# EAGLE design Audio-1 (EAGLE 7.2.0)
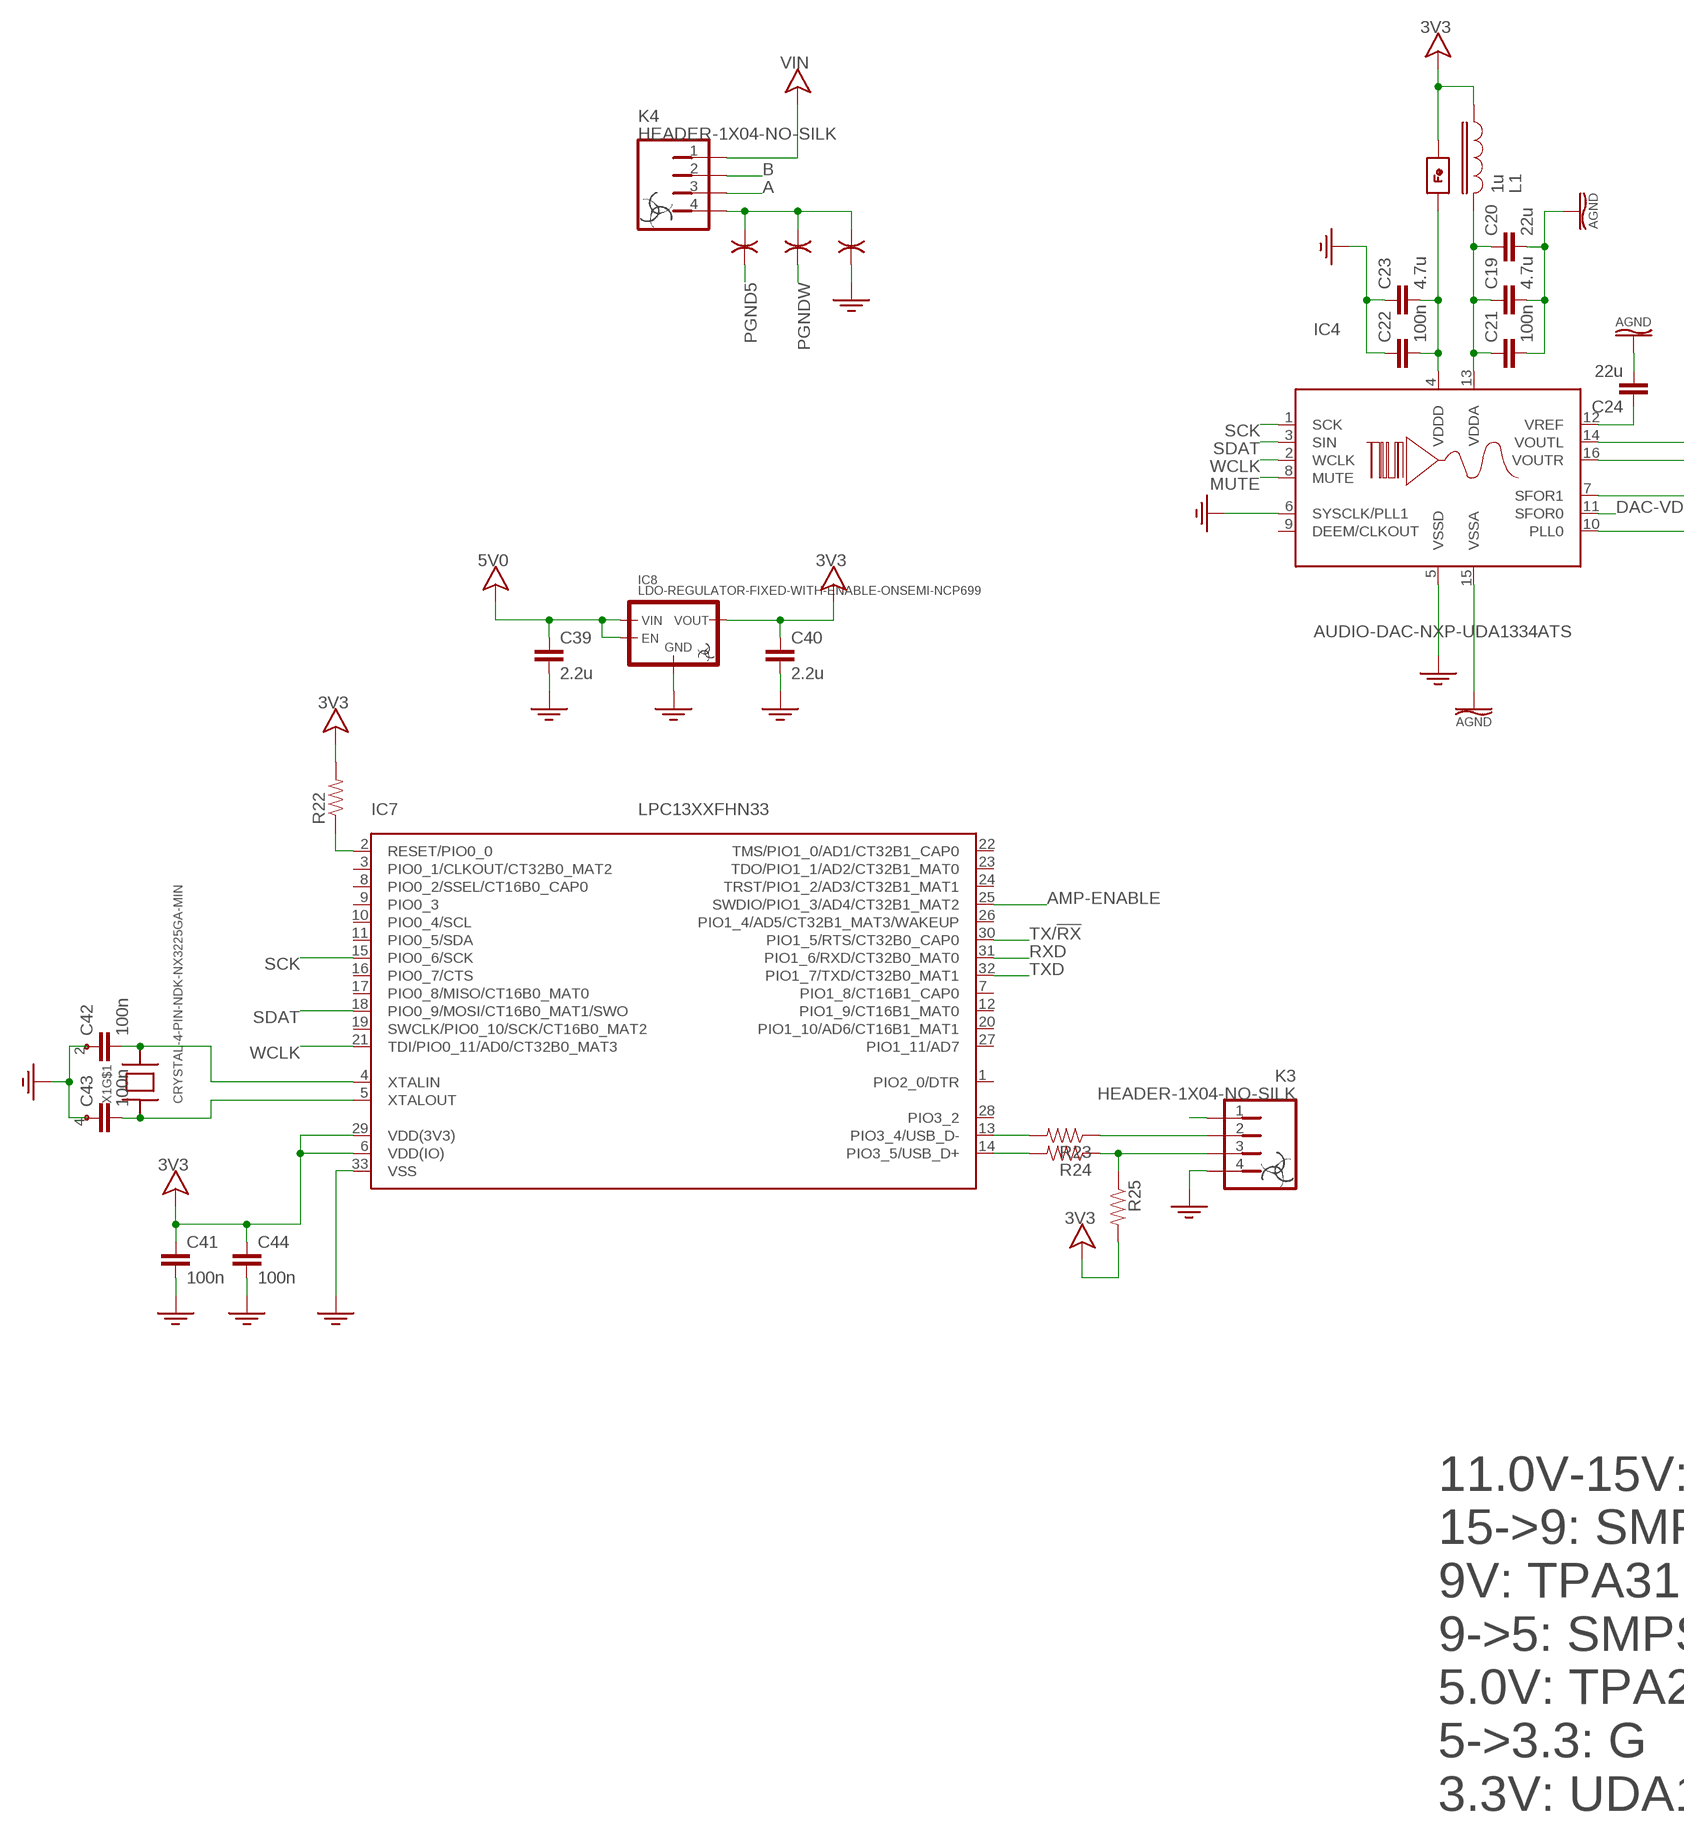
[diagram p0: schematic, sheet 1, part 1 of 2]
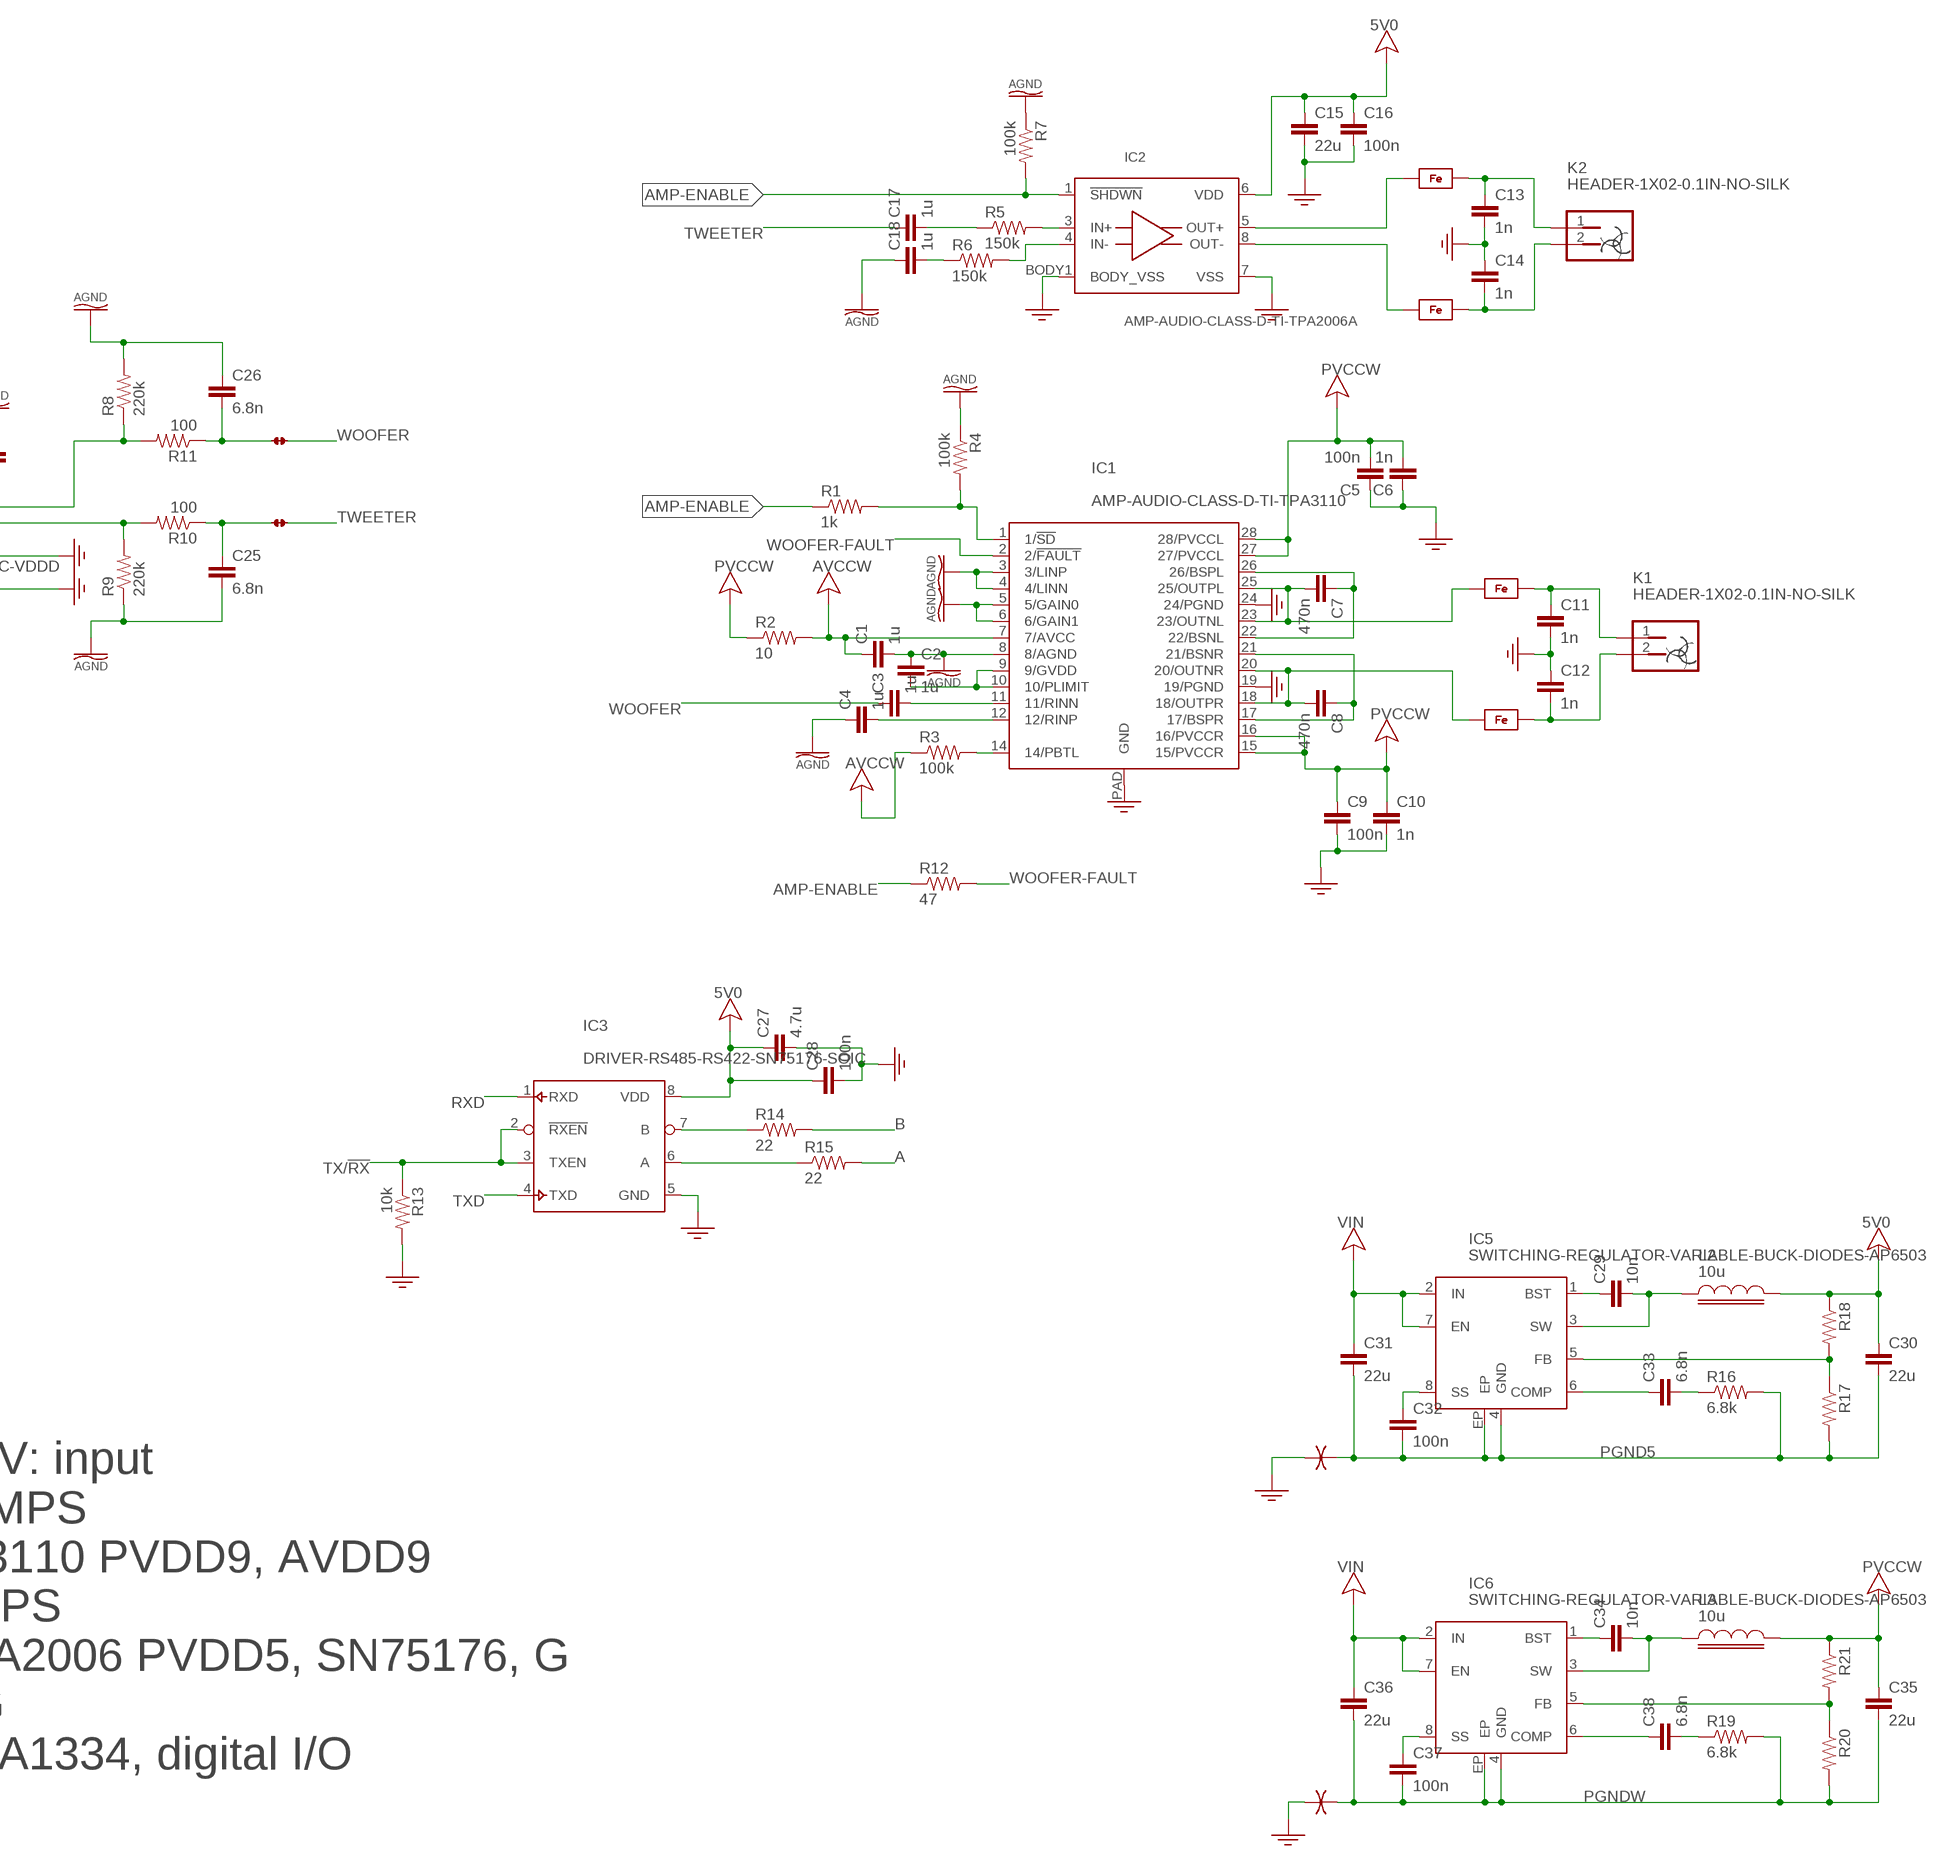
[diagram p1: schematic, sheet 1, part 2 of 2]

## Parts
C1  1u  CAP-0603-MIN  [0603-MIN]
C2  1u  CAP-0603-MIN  [0603-MIN]
C3  1u  CAP-0603-MIN  [0603-MIN]
C4  1u  CAP-0603-MIN  [0603-MIN]
C5  100n  CAP-0603-MIN  [0603-MIN]
C6  1n  CAP-0603-MIN  [0603-MIN]
C7  470n  CAP-0603-MIN  [0603-MIN]
C8  470n  CAP-0603-MIN  [0603-MIN]
C9  100n  CAP-0603-MIN  [0603-MIN]
C10  1n  CAP-0603-MIN  [0603-MIN]
C11  1n  CAP-0603-MIN  [0603-MIN]
C12  1n  CAP-0603-MIN  [0603-MIN]
C13  1n  CAP-0603-MIN  [0603-MIN]
C14  1n  CAP-0603-MIN  [0603-MIN]
C15  22u  CAP-1206-MIN  [1206-MIN]
C16  100n  CAP-0603-MIN  [0603-MIN]
C17  1u  CAP-0603-MIN  [0603-MIN]
C18  1u  CAP-0603-MIN  [0603-MIN]
C19  4.7u  CAP-0805-WIDE  [0805-WIDE]
C20  22u  CAP-1206-MIN  [1206-MIN]
C21  100n  CAP-0603-MIN  [0603-MIN]
C22  100n  CAP-0603-MIN  [0603-MIN]
C23  4.7u  CAP-0805-WIDE  [0805-WIDE]
C24  22u  CAP-1206-MIN  [1206-MIN]
C25  6.8n  CAP-0603  [0603]
C26  6.8n  CAP-0603  [0603]
C27  4.7u  CAP-0805  [0805]
C28  100n  CAP-0603-MIN  [0603-MIN]
C29  10n  CAP-0603-MIN  [0603-MIN]
C30  22u  CAP-1206  [1206]
C31  22u  CAP-1206  [1206]
C32  100n  CAP-0603-MIN  [0603-MIN]
C33  6.8n  CAP-0603-MIN  [0603-MIN]
C34  10n  CAP-0603-MIN  [0603-MIN]
C35  22u  CAP-1206  [1206]
C36  22u  CAP-1206  [1206]
C37  100n  CAP-0603-MIN  [0603-MIN]
C38  6.8n  CAP-0603-MIN  [0603-MIN]
C39  2.2u  CAP-0603-MIN  [0603-MIN]
C40  2.2u  CAP-0603-MIN  [0603-MIN]
C41  100n  CAP-0603-MIN  [0603-MIN]
C42  100n  CAP-0603-MIN  [0603-MIN]
C43  100n  CAP-0603-MIN  [0603-MIN]
C44  100n  CAP-0603-MIN  [0603-MIN]
FB1  FERRITE-BEAD-0603-MIN  [0603-MIN]
FB2  FERRITE-BEAD-0603-MIN  [0603-MIN]
FB3  FERRITE-BEAD-0603-MIN  [0603-MIN]
FB4  FERRITE-BEAD-0603-MIN  [0603-MIN]
FB5  FERRITE-BEAD-0603-MIN  [0603-MIN]
IC1  AMP-AUDIO-CLASS-D-TI-TPA3110  [SSOP28-5.3MM-POWERPAD]
IC2  AMP-AUDIO-CLASS-D-TI-TPA2006A  [QFN8-3X3MM-TI-TPA200X]
IC3  DRIVER-RS485-RS422-SN75176-SOIC  [EIAJ-SOIC8]
IC4  AUDIO-DAC-NXP-UDA1334ATS  [TSSOP16]
IC5  SWITCHING-REGULATOR-VARIABLE-BUCK-DIODES-AP6503  [EIAJ-SOIC8-3.9MM-EXPOSED-PAD]
IC6  SWITCHING-REGULATOR-VARIABLE-BUCK-DIODES-AP6503  [EIAJ-SOIC8-3.9MM-EXPOSED-PAD]
IC7  LPC13XXFHN33  [HVQFN33-7X7MM]
IC8  LDO-REGULATOR-FIXED-WITH-ENABLE-ONSEMI-NCP699  [SOT23-5]
J1  JUMPER-0805  [0805-JUMPER]
J2  JUMPER-0805  [0805-JUMPER]
K1  HEADER-1X02-0.1IN-NO-SILK  [HEADER-1X02-NO-SILK]
K2  HEADER-1X02-0.1IN-NO-SILK  [HEADER-1X02-NO-SILK]
K3  HEADER-1X04-NO-SILK  [HEADER-1X04-NO-SILK]
K4  HEADER-1X04-NO-SILK  [HEADER-1X04-NO-SILK]
L1  1u  INDUCTOR-0805-MIN  [0805-MIN]
L2  10u  INDUCTOR-1210  [1210]
L3  10u  INDUCTOR-1210  [1210]
R1  1k  RESISTOR-0603-MIN  [0603-MIN]
R2  10  RESISTOR-0603-MIN  [0603-MIN]
R3  100k  RESISTOR-0603-MIN  [0603-MIN]
R4  100k  RESISTOR-0603-MIN  [0603-MIN]
R5  150k  RESISTOR-0603-MIN  [0603-MIN]
R6  150k  RESISTOR-0603-MIN  [0603-MIN]
R7  100k  RESISTOR-0603-MIN  [0603-MIN]
R8  220k  RESISTOR-0603  [0603]
R9  220k  RESISTOR-0603  [0603]
R10  100  RESISTOR-0603  [0603]
R11  100  RESISTOR-0603  [0603]
R12  47  RESISTOR-0603-MIN  [0603-MIN]
R13  10k  RESISTOR-0603-MIN  [0603-MIN]
R14  22  RESISTOR-0805  [0805-MIN]
R15  22  RESISTOR-0805  [0805-MIN]
R16  6.8k  RESISTOR-0603-MIN  [0603-MIN]
R17  RESISTOR-0603-MIN  [0603-MIN]
R18  RESISTOR-0603-MIN  [0603-MIN]
R19  6.8k  RESISTOR-0603-MIN  [0603-MIN]
R20  RESISTOR-0603-MIN  [0603-MIN]
R21  RESISTOR-0603-MIN  [0603-MIN]
R22  RESISTOR-0603-MIN  [0603-MIN]
R23  RESISTOR-0603-MIN  [0603-MIN]
R24  RESISTOR-0603-MIN  [0603-MIN]
R25  RESISTOR-0603-MIN  [0603-MIN]
U1  GND-ISOLATOR-0.032"  [GND-ISOLATOR-0.032"]
U2  GND-ISOLATOR-0.032"  [GND-ISOLATOR-0.032"]
U3  GND-ISOLATOR-0.032"  [GND-ISOLATOR-0.032"]
U4  GND-ISOLATOR-0.032"  [GND-ISOLATOR-0.032"]
U5  GND-ISOLATOR-0.032"  [GND-ISOLATOR-0.032"]
X1  CRYSTAL-4-PIN-NDK-NX3225GA-MIN  [CRYSTAL-NDK-NX3225GA-3X2.5MM-MIN]

## Nets
3V3: C40.2 C41.2 C44.2 FB5.2 IC7.6(VDD(IO)) IC7.29(VDD(3V3)) IC8.5(VOUT) L1.2 R22.2 R25.2 ; supply symbol labelled V
5V0: C15.2 C16.2 C27.2 C28.2 C30.2 C39.2 IC2.6(VDD) IC3.8(VDD) IC8.1(VIN) IC8.3(EN) L2.2 R18.1 ; supply symbol labelled V
5V0FB: IC5.5(FB) R17.1 R18.2
!WOOFER-SD: IC1.1(1/!SD) R1.2 R4.2
A: K4.3 R15.2
AGND: C1.1 C2.2 C4.2 C18.2 C19.1 C20.1 C21.1 C24.1 C25.1 C26.2 IC1.3(3/LINP) IC1.4(4/LINN) IC1.5(5/GAIN0) IC1.6(6/GAIN1) IC1.8(8/AGND) IC4.15(VSSA) R4.1 R7.1 R8.2 R9.1
AMP-ENABLE: IC2.1(!SHDWN) IC7.25(SWDIO/PIO1_3/AD4/CT32B1_MAT2) R1.1 R7.2 R12.1
AVCCW: C1.2 IC1.7(7/AVCC) R2.2 R3.1 ; supply symbol labelled V
B: K4.2 R14.2
BSL: C7.2 IC1.22(22/BSNL) IC1.26(26/BSPL)
BSR: C8.2 IC1.17(17/BSPR) IC1.21(21/BSNR)
D+: K3.3 R24.1 R25.1
D-: K3.2 R23.1
DAC-TO: C25.2 J2.1 R10.1
DAC-VDDA: C19.2 C20.2 C21.2 IC4.13(VDDA) L1.1
DAC-VDDD: C22.1 C23.1 FB5.1 IC4.4(VDDD) IC4.11(SFOR0)
DAC-VOUT-TO: IC4.16(VOUTR) R9.2 R10.2
DAC-VOUT-WO: IC4.14(VOUTL) R8.1 R11.2
DAC-WO: C26.1 J1.1 R11.1
GND: C5.2 C6.2 C9.1 C10.1 C11.1 C12.2 C13.1 C14.2 C15.1 C16.1 C22.2 C23.2 C27.1 C28.1 C39.1 C40.1 C41.1 C42.2 C43.2 C44.1 IC1.19(19/PGND) IC1.24(24/PGND) IC1.PAD(GND) IC2.7(VSS) IC2.BODY1(BODY_VSS) IC3.5(GND) IC4.5(VSSD) IC4.6(SYSCLK/PLL1) IC4.7(SFOR1) IC4.10(PLL0) IC7.33(VSS) IC8.2(GND) K3.4 R13.2 U3.A U4.B U5.B X1.2 X1.4
GVDD: C2.1 IC1.9(9/GVDD) IC1.10(10/PLIMIT)
MUTE: IC4.8(MUTE)
N$1: IC3.7(B) R14.1
N$2: C24.2 IC4.12(VREF)
N$3: IC3.6(A) R15.1
N$4: C29.1 IC5.3(SW) L2.1
N$5: C29.2 IC5.1(BST)
N$6: C34.1 IC6.3(SW) L3.1
N$7: C34.2 IC6.1(BST)
N$8: FB3.1 IC2.5(OUT+)
N$9: IC1.14(14/PBTL) R3.2
N$10: C38.2 IC6.6(COMP)
N$11: C33.2 IC5.6(COMP)
N$12: FB4.1 IC2.8(OUT-)
N$13: C14.1 FB4.2 K2.2
N$14: C13.2 FB3.2 K2.1
N$15: C33.1 R16.1
N$16: C38.1 R19.1
N$17: C32.2 IC5.8(SS)
N$18: C37.2 IC6.8(SS)
N$19: IC7.2(RESET/PIO0_0) R22.1
N$20: IC2.3(IN+) R5.2
N$21: IC2.4(IN-) R6.2
N$22: C18.1 R6.1
N$23: C17.1 R5.1
N$24: IC7.13(PIO3_4/USB_D-) R23.2
N$25: IC7.14(PIO3_5/USB_D+) R24.2
N$26: C43.1 IC7.5(XTALOUT) X1.1
N$27: C42.1 IC7.4(XTALIN) X1.3
N$28: K4.4 U1.B U2.B U3.B
N$30: K3.1
OUTL: C7.1 FB1.1 IC1.23(23/OUTNL) IC1.25(25/OUTPL)
OUTR: C8.1 FB2.1 IC1.18(18/OUTPR) IC1.20(20/OUTNR)
PGND5: C30.1 C31.1 C32.1 IC5.4(GND) IC5.EP R16.2 R17.2 U1.A U4.A
PGNDW: C35.1 C36.1 C37.1 IC6.4(GND) IC6.EP R19.2 R20.2 U2.A U5.A
PVCCW: C5.1 C6.1 C9.2 C10.2 C35.2 IC1.15(15/PVCCR) IC1.16(16/PVCCR) IC1.27(27/PVCCL) IC1.28(28/PVCCL) L3.2 R2.1 R21.1 ; supply symbol labelled V
RINN: C3.1 IC1.11(11/RINN)
RINP: C4.1 IC1.12(12/RINP)
RXD: IC3.1(RXD) IC7.31(PIO1_6/RXD/CT32B0_MAT0)
SCK: IC4.1(SCK) IC7.15(PIO0_6/SCK)
SDAT: IC4.3(SIN) IC7.18(PIO0_9/MOSI/CT16B0_MAT1/SWO)
TWEETER: C17.2 J2.2
TX/!RX: IC3.2(!RXEN) IC3.3(TXEN) IC7.30(PIO1_5/RTS/CT32B0_CAP0) R13.1
TXD: IC3.4(TXD) IC7.32(PIO1_7/TXD/CT32B0_MAT1)
VIN: C31.2 C36.2 IC5.2(IN) IC5.7(EN) IC6.2(IN) IC6.7(EN) K4.1 ; supply symbol labelled V
WCLK: IC4.2(WCLK) IC7.21(TDI/PIO0_11/AD0/CT32B0_MAT3)
WFB: IC6.5(FB) R20.1 R21.2
WOOFER: C3.2 J1.2
WOOFER-FAULT: IC1.2(2/!FAULT) R12.2
WOOFERL: C11.2 FB1.2 K1.1
WOOFERR: C12.1 FB2.2 K1.2
Unconnected: IC4.9(DEEM/CLKOUT) IC7.1(PIO2_0/DTR) IC7.3(PIO0_1/CLKOUT/CT32B0_MAT2) IC7.7(PIO1_8/CT16B1_CAP0) IC7.8(PIO0_2/SSEL/CT16B0_CAP0) IC7.9(PIO0_3) IC7.10(PIO0_4/SCL) IC7.11(PIO0_5/SDA) IC7.12(PIO1_9/CT16B1_MAT0) IC7.16(PIO0_7/CTS) IC7.17(PIO0_8/MISO/CT16B0_MAT0) IC7.19(SWCLK/PIO0_10/SCK/CT16B0_MAT2) IC7.20(PIO1_10/AD6/CT16B1_MAT1) IC7.22(TMS/PIO1_0/AD1/CT32B1_CAP0) IC7.23(TDO/PIO1_1/AD2/CT32B1_MAT0) IC7.24(TRST/PIO1_2/AD3/CT32B1_MAT1) IC7.26(PIO1_4/AD5/CT32B1_MAT3/WAKEUP) IC7.27(PIO1_11/AD7) IC7.28(PIO3_2)

## Notes on the sheet
- 11.0V-15V: input
  15->9: SMPS
  9V: TPA3110 PVDD9, AVDD9
  9->5: SMPS
  5.0V: TPA2006 PVDD5, SN75176, G
  5->3.3: G
  3.3V: UDA1334, digital I/O

## Library data of the parts
C1-C44 = Outbreak:CAP
FB1-FB5 = Outbreak:FERRITE-BEAD
IC1 = Outbreak:AMP-AUDIO-CLASS-D-TI-TPA3110
IC2 = Outbreak:AMP-AUDIO-CLASS-D-TI-TPA2006A
IC3 = Outbreak:DRIVER-RS485-RS422-SN75176
IC4 = Outbreak:AUDIO-DAC-NXP-UDA1334ATS
IC5 IC6 = Outbreak:SWITCHING-REGULATOR-VARIABLE-BUCK-DIODES-AP6503
IC7 = Outbreak:LPC13XXFHN33: LPC1313 72 MHz 32-bit ARM Cortex-M3 based microcontroller featuring a high level of integration and low power consumption. 32 kB Flash, 8 kB SRAM MarcVl - Datasheet available on www.nxp.com
IC8 = Outbreak:LDO-REGULATOR-FIXED-WITH-ENABLE: Low Drop-Out (LDO) Volt Regulator with enable pin (active at logic high.)
J1 J2 = Outbreak:JUMPER
K1 K2 = Outbreak:HEADER-1X02
K3 K4 = Outbreak:HEADER-1X04-NO-SILK
L1-L3 = Outbreak:INDUCTOR
R1-R25 = Outbreak:RESISTOR: Resistor Basic schematic elements and footprints for 0603, 1206, and PTH resistors.
U1-U5 = Outbreak:GND-ISOLATOR
X1 = Outbreak:CRYSTAL-4-PIN

## Board
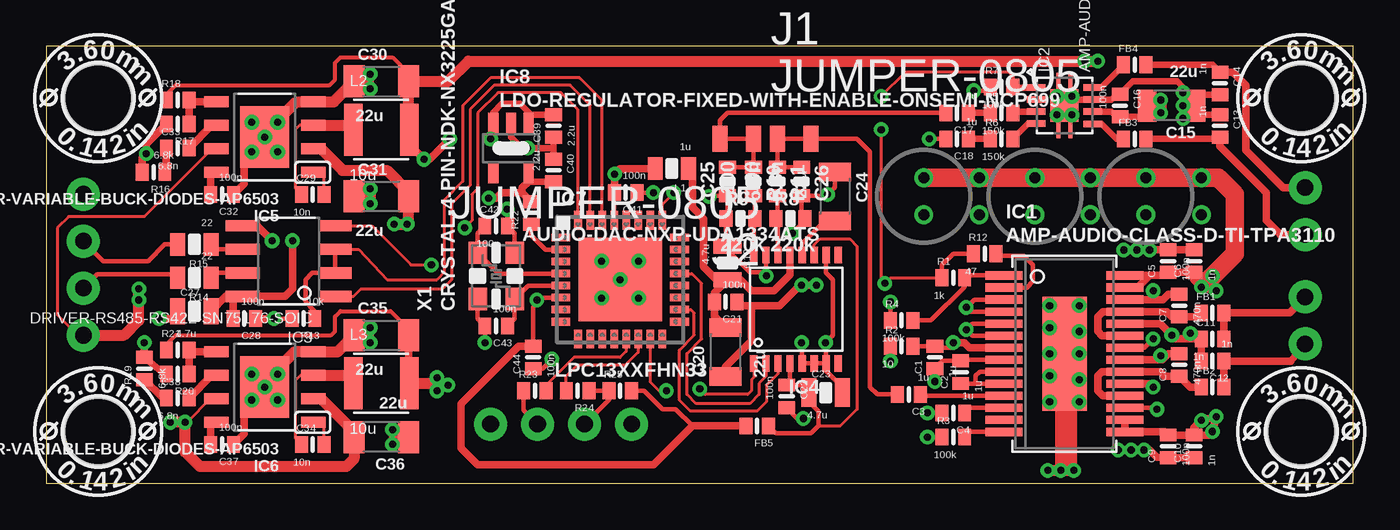
[diagram p2: board, top side]
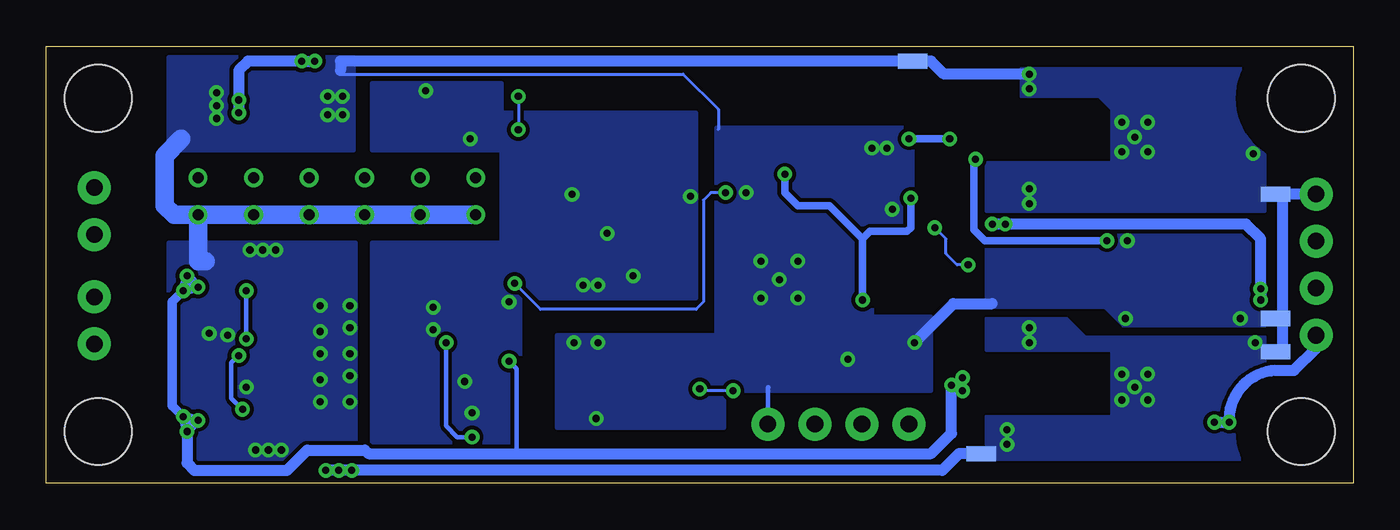
[diagram p3: board, bottom side, seen from below]

Size 70.6 x 23.6 mm. Coordinates in mm from the lower left corner, seen from the top.
Outline: 0,0 70.6,0 70.6,23.6 0,23.6 0,0
Copper layers (1*16): Top 0.035mm / dielectric 1.5mm / Bottom 0.035mm
Design rules "default *": minimum track width 10mil, minimum drill 24mil, track to track 8mil, track to pad 8mil, pad to pad 8mil, via to via 8mil, smd to smd 8mil, copper to edge 10mil, drill to drill 8mil, minimum pad ring 10mil, minimum via ring 8mil, stop-mask expansion 4mil, vias tented up to drill 20mil, thermal gap 10mil

### Footprints (pad centres in the part's own frame; a part is rotated, then mirrored left to right if it is on the bottom)
0603-MIN = smd 0.7 x 0.9: 1 -0.61,0; 2 0.61,0
1206-MIN = smd 1 x 1.727: 1 -1.323,0; 2 1.323,0
0805-WIDE = smd 0.8 x 1.524: 1 -0.9,0; 2 0.9,0
0603 = smd 0.7 x 0.9: 1 -0.777,0; 2 0.777,0
0805 = smd 0.8 x 1.397: 1 -0.9,0; 2 0.9,0
1206 = smd 1.143 x 1.727: 1 -1.473,0; 2 1.473,0
SSOP28-5.3MM-POWERPAD = smd 2 x 0.44: 1 -3.275,4.225; 2 -3.275,3.575; 3 -3.275,2.925; 4 -3.275,2.275; 5 -3.275,1.625; 6 -3.275,0.975; 7 -3.275,0.325; 8 -3.275,-0.325; 9 -3.275,-0.975; 10 -3.275,-1.625; 11 -3.275,-2.275; 12 -3.275,-2.925; 13 -3.275,-3.575; 14 -3.275,-4.225; 15 3.275,-4.225; 16 3.275,-3.575; 17 3.275,-2.925; 18 3.275,-2.275; 19 3.275,-1.625; 20 3.275,-0.975; 21 3.275,-0.325; 22 3.275,0.325; 23 3.275,0.975; 24 3.275,1.625; 25 3.275,2.275; 26 3.275,2.925; 27 3.275,3.575; 28 3.275,4.225 | smd 2.4 x 6.17: PAD 0,0
QFN8-3X3MM-TI-TPA200X = smd 0.35 x 1: 1 0.975,1.525; 2 0.325,1.525; 3 -0.325,1.525; 4 -0.975,1.525; 5 -0.985,-1.525; 6 -0.325,-1.525; 7 0.325,-1.525; 8 0.975,-1.525 | smd 1.75 x 1.5: BODY1 0,0 | smd 0.9 x 0.23: BODY2 -1.325,0.325; BODY3 -1.325,-0.325; BODY4 1.325,-0.325; BODY5 1.325,0.325
EIAJ-SOIC8 = smd 1.829 x 0.61: 1 -2.491,1.905; 2 -2.491,0.635; 3 -2.491,-0.635; 4 -2.491,-1.905; 5 2.491,-1.905; 6 2.491,-0.635; 7 2.491,0.635; 8 2.491,1.905
TSSOP16 = smd 0.4 x 0.9: 1 2.275,2.925; 2 1.625,2.925; 3 0.975,2.925; 4 0.325,2.925; 5 -0.325,2.925; 6 -0.975,2.925; 7 -1.625,2.925; 8 -2.275,2.925; 9 -2.275,-2.925; 10 -1.625,-2.925; 11 -0.975,-2.925; 12 -0.325,-2.925; 13 0.325,-2.925; 14 0.975,-2.925; 15 1.625,-2.925; 16 2.275,-2.925
EIAJ-SOIC8-3.9MM-EXPOSED-PAD = smd 1.321 x 0.61: 1 -2.618,1.905; 2 -2.618,0.635; 3 -2.618,-0.635; 4 -2.618,-1.905; 5 2.618,-1.905; 6 2.618,-0.635; 7 2.618,0.635; 8 2.618,1.905 | smd 2.66 x 3.3: EP 0,0
HVQFN33-7X7MM = smd 1.013 x 0.406: 1 -3.2,2.275; 2 -3.2,1.625; 3 -3.2,0.975; 4 -3.2,0.325; 5 -3.2,-0.325; 6 -3.2,-0.975; 7 -3.2,-1.625; 8 -3.2,-2.275; 17 3.2,-2.275; 18 3.2,-1.625; 19 3.2,-0.975; 20 3.2,-0.325; 21 3.2,0.325; 22 3.2,0.975; 23 3.2,1.625; 24 3.2,2.275 | smd 0.406 x 1.013: 9 -2.275,-3.2; 10 -1.625,-3.2; 11 -0.975,-3.2; 12 -0.325,-3.2; 13 0.325,-3.2; 14 0.975,-3.2; 15 1.625,-3.2; 16 2.275,-3.2; 25 2.275,3.2; 26 1.625,3.2; 27 0.975,3.2; 28 0.325,3.2; 29 -0.325,3.2; 30 -0.975,3.2; 31 -1.625,3.2; 32 -2.275,3.2 | smd 4.5 x 4.5: 33 0,0
SOT23-5 = smd 0.55 x 1.2: 1 0.95,1.3; 2 0,1.3; 3 -0.95,1.3; 4 -0.95,-1.3; 5 0.95,-1.3
0805-JUMPER = smd 0.8 x 1.397: 1 -0.9,0; 2 0.9,0
HEADER-1X02-NO-SILK = drill 0.9 pad 1.778: 1 -1.27,0; 2 1.27,0
HEADER-1X04-NO-SILK = drill 0.9 pad 1.778: 1 0,0; 2 2.54,0; 3 5.08,0; 4 7.62,0
0805-MIN = smd 0.8 x 1.2: 1 -0.9,0; 2 0.9,0
1210 = smd 1 x 2.8: 1 -1.5,0; 2 1.5,0
GND-ISOLATOR-0.032" = smd 0.813 x 0.813: A -0.381,0; B 0.381,0
MOUNTING-HOLE-3.6MM-LABELLED-DIAM = hole 3.619: 0,0
CRYSTAL-NDK-NX3225GA-3X2.5MM-MIN = smd 1.2 x 1: 1 -1.25,-1; 2 1.25,-1; 3 1.25,1; 4 -1.25,1

### Placement (x,y rotation side)
C1  48,6.8 90 top
C2  49.4,6 90 top
C3  46.6,4.8 180 top
C4  49,3.8 180 top
C5  60.6,12 90 top
C6  62,12 90 top
C7  61.2,9.6 90 top
C8  61.2,6.4 90 top
C9  60.6,2 90 top
C10  62,2 90 top
C11  63,7.8 0 top
C12  63,6.6 180 top
C13  63.4,19.3 270 top
C14  63.4,21.6 270 top
C15  60.8,20.4 180 top
C16  58,20.4 270 top
C17  49.2,20 180 top
C18  49.2,18.6 180 top
C19  36.8,11.9 270 top
C20  36.7,7.1 90 top
C21  36.7,9.8 180 top
C22  40,4.7 270 top
C23  42.1,4.9 0 top
C24  42.6,15.5 270 top
C25  36.8,16.3 90 top
C26  40.8,16.3 270 top
C27  8,9.3 0 top
C28  10.7,8.9 180 top
C29  14.4,15.6 0 top
C30  18.1,21.7 0 top
C31  18.1,15.5 0 top
C32  9.5,15.6 180 top
C33  7.1,18.1 0 top
C34  14.4,2.1 0 top
C35  18.1,8 0 top
C36  18.1,2.5 180 top
C37  9.5,2.1 180 top
C38  7.1,4.6 0 top
C39  27.4,19.3 90 top
C40  27.4,16.9 270 top
C41  31.3,15.7 180 top
C42  24.3,13.9 0 top
C43  24.3,8.5 180 top
C44  26.3,6.8 90 top
FB1  63,9.2 0 top
FB2  63,5.2 0 top
FB3  58.8,18.6 0 top
FB4  58.8,22.6 0 top
FB5  38.4,3.1 180 top
IC1  55,7 0 top
IC2  55,20.4 90 top
IC3  13.1,12 180 top
IC4  40.5,9.4 180 top
IC5  11.8,18.7 180 top
IC6  11.8,5.2 180 top
IC7  31,11 0 top
IC8  25.1,18.1 0 top
J1  40.4,18.6 0 top
J2  37.3,18.6 180 top
K1  68,8.8 270 top
K2  68,14.7 90 top
K3  24,3.2 0 top
K4  2,8 90 top
L1  33.8,17 180 top
L2  18.1,19.1 0 top
L3  18.1,5.4 0 top
R1  49,11.1 0 top
R2  46.2,7.4 0 top
R3  49,2.5 0 top
R4  46.2,8.8 0 top
R5  51.6,20 0 top
R6  51.6,18.6 0 top
R7  51.6,21.4 0 top
R8  40.2,14.3 0 top
R9  37.5,14.3 0 top
R10  38.2,16.3 270 top
R11  39.5,16.3 270 top
R12  50.7,12.4 0 top
R13  13.9,8.9 180 top
R14  8,11.1 180 top
R15  8,12.9 180 top
R16  5.8,16.8 180 top
R17  7.1,19.4 180 top
R18  7.1,20.7 0 top
R19  5.3,6.2 90 top
R20  7.1,5.9 180 top
R21  7.1,7.2 0 top
R22  26.2,14.6 90 top
R23  26.4,5 0 top
R24  28.7,5 180 top
R25  31,5 0 top
U1  4.2,15.6 0 bottom
U2  4.2,7.1 0 bottom
U3  4.2,8.9 0 bottom
U4  23.8,22.8 180 bottom
U5  20.1,1.6 180 bottom
U$1  [MOUNTING-HOLE-3.6MM-LABELLED-DIAM]  2.8,2.8 0 top
U$9  [MOUNTING-HOLE-3.6MM-LABELLED-DIAM]  67.8,2.8 0 top
U$10  [MOUNTING-HOLE-3.6MM-LABELLED-DIAM]  2.8,20.8 0 top
U$16  [MOUNTING-HOLE-3.6MM-LABELLED-DIAM]  67.8,20.8 0 top
X1  24.3,11.2 90 top

### Tracks (layer width: path | path; a pad name or v marks a point on that pad's centre or on a via)
3V3  (via drill 0.38)
  Top 0.25: R25.2 32.3,5 33.3,4 34,4
  Top 0.254: IC7.6 26.82,10.03 26.7,9.9 | 26.7,9.9 26.3,9.5 C44.2 | IC7.29 30.68,15.79 C41.2 | 34.9,3.1 34,4 | 26.05,17.2 IC8.5 | 26.7,9.9 v26.5,9.9
  Top 0.35: C40.2 26.05,16.29 IC8.5
  Top 0.4: L1.2 31,17 v30.69,16.69 C41.2 30.7,15.81 v30.7,16.7 | v23.9,15.4 24.3,15.4 24.6,15.7 25.71,15.7 | 25.71,15.7 R22.2 | C44.2 25.51,7.41 22.4,4.3 22.4,1.9 23.3,1 32.8,1 34.9,3.1 FB5.2 | 26.05,16.29 25.71,15.95 25.71,15.7
  Bottom 0.4: v26.5,9.9 26.5,13.2 | 26.5,13.2 26.1,13.6 24.1,13.6 23.9,13.8 v23.9,15.4 | 26.5,13.2 28.3,15 30,15 C41.2 v30.7,16.7
5V0  (via drill 0.38)
  Top 0.203: R18.1 6.49,20.99 7,21.5 15.3,21.5 15.6,21.8 15.6,22.7 15.9,23 18.7,23 19.57,22.13 C30.2
  Top 0.35: IC8.1 26.05,19.91 | IC8.3 24.15,20.05 24.6,20.5 25.6,20.5 26.05,20.05 26.05,19.91 | C39.2 26.05,19.91 | IC2.6 57.52,20.07 57.81,19.79 C16.2 59.48,19.79 59.48,20
  Top 0.4: 10.1,10.1 IC3.8 12.89,10.1 13.3,10.5 v13.3,13.1 | 10.1,10.1 9.7,10.1 C27.2 | C28.2 10.09,10.09 10.1,10.1 | L2.2 19.6,18.3 v20.4,17.5 20.7,17.5 v21.8,18.6 | IC8.3 24.15,18.75 v24,18.6
  Top 0.6: L2.2 19.57,19.1 C30.2 21.7,21.7 22.8,22.8 v56.1,22.8 v56.8,22.8 | C15.2 59.48,20 v60.2,20 v60.2,20.7
  Bottom 0.4: v13.3,13.1 19.9,13.1 20.5,13.7 20.5,17.4 v20.4,17.5 | v24,18.6 v21.8,18.6
  Bottom 0.6: v60.2,20 v60.2,20.7 60.2,22.3 59.7,22.8 v56.8,22.8 v56.1,22.8
5V0FB
  Top 0.4: IC5.5 7.8,20.61 R18.2 R17.1
!WOOFER-SD
  Top 0.254: IC1.1 49.78,11.22 | 49.78,11.22 R1.2 | R4.2 47.8,8.8 49.6,10.6 49.6,11.04 49.78,11.22
A
  Top 0.254: R15.2 6.4,12.9 5.5,12 3.08,12 K4.3
AGND  (via drill 0.38)
  Top 0.254: IC1.3 50.12,9.93 v49.7,9.5 49.92,9.28 IC1.4 | IC1.6 50.02,7.97 v49.7,8.3 50.02,8.62 IC1.5 | C18.2 v47.7,18.6 | R4.1 v45.59,9.79 v45.6,9.8 | IC1.8 49.47,6.67 C2.2 48.42,6.61 C1.1 v48,5.5 | C4.2 v47.6,3.8 | IC4.15 38.88,11.47 | 38.88,11.47 38.8,11.4 38,11.4 36.8,12.6 C19.1 36.72,12.88 R9.1 36.8,14.38 C25.1 35.82,15.52 v35.8,15.5 | 38.88,11.47 38.88,11.22 v38.9,11.2 | v40.3,13.5 40.9,14.1 40.9,14.3 R8.2 40.8,14.48 C26.2 42.12,15.52 v42.2,15.6 42.6,16 C24.1 | R7.1 50.99,21.21 51,21.2 v50.1,21.2
  Top 0.4: 38.1,9.6 39.6,9.6 40.7,10.7 v40.8,10.7 v41.6,10.7 | 38.1,9.6 37.31,9.6 C21.1 | C20.1 36.7,6.3 38.1,7.7 38.1,9.6
  pour Bottom: 45,1 45,10 35.5,10 35.5,20 46,20 46,21.6 53,21.6 53,18 46,18 46,13 53,13 53,1
AMP-ENABLE  (via drill 0.38)
  Top 0.152: IC7.25 33.27,15.07 v33.9,15.7 | R1.1 45.6,11.1 v45.3,10.8 45.1,11 v45.1,19.1 | 52.23,21.38 52.23,21.96 52,22.2 46.4,22.2 v45.1,20.9
  Top 0.254: R1.1 48.39,11.79 49,12.4 R12.1
  Top 0.35: IC2.1 52.23,21.38 R7.2
  Bottom 0.152: v33.9,15.7 34.7,15.7 35.1,15.3 35.1,9.8 35.5,9.4 43.9,9.4 v45.3,10.8 | v45.1,20.9 v45.1,19.1
AVCCW  (via drill 0.38)
  Top 0.25: 48.09,7.33 C1.2
  Top 0.254: R3.1 v47.6,2.5 | 48.09,7.33 49,7.33 v49,7.6 | C1.2 R2.2
  Top 0.4: IC1.7 49.88,7.33 49.6,7.6 v49,7.6
  Bottom 0.254: v47.6,2.5 R3.1 49,3.1 v49,7.6
B
  Top 0.254: R14.2 6.9,11.3 2.76,11.3 K4.2
BSL  (via drill 0.38)
  Top 0.254: IC1.22 59.33,7.33 v59.8,7.8 | 59.8,9.93 v59.8,10.4
  Top 0.4: IC1.26 59.8,9.93 60.33,9.93 60.61,10.21 C7.2
  Bottom 0.254: v59.8,10.4 v59.8,7.8
BSR  (via drill 0.38)
  Top 0.254: IC1.17 59.92,4.08 v60,4 | 60.2,6.67 v60.2,6.9
  Top 0.4: IC1.21 60.2,6.67 60.27,6.67 60.61,7.01 C8.2
  Bottom 0.254: v60.2,6.9 60.6,6.5 60.6,4.6 v60,4
D+
  Top 0.254: R24.1 R25.1 30.39,4.51 K3.3
D-
  Top 0.254: R23.1 25.79,3.95 K3.2
DAC-TO
  Top 0.254: C25.2 R10.1 J2.1
DAC-VDDA
  Top 0.4: IC4.13 40.17,11.28 39.3,10.4 38.1,10.4 37.5,11 C19.2 | C19.2 36.09,10.29 C21.2 36.09,9.03 C20.2 | L1.1 34.9,16.8 34.9,14.9 35.5,14.3 35.5,11.7 36.2,11 C19.2
DAC-VDDD
  Top 0.152: IC4.11 41.48,12.88 41.8,13.2 43.4,13.2 43.8,12.8 43.8,4 42.9,3.1 41.7,3.1
  Top 0.254: IC4.4 40.17,5.47 C22.1 40.8,5.3 C23.1 41.1,4.5 41.7,3.9 41.7,3.1 41.3,2.7 39.41,2.7 FB5.1
DAC-VOUT-TO
  Top 0.254: IC4.16 38.23,14.25 R9.2 38.28,15.45 R10.2
DAC-VOUT-WO
  Top 0.254: IC4.14 39.52,14.2 R8.1 39.5,14.38 R11.2
DAC-WO
  Top 0.254: C26.1 R11.1 J1.1
GND  (via drill 0.38, 0.6)
  Top 0.254: v54.2,7 IC1.PAD | IC4.7 IC4.6 IC4.5 40.83,7.58 v40.8,7.6 | IC4.7 42.12,6.08 42.9,5.3 C23.2 | v40.9,3.5 40.59,3.5 C22.2 | R13.2 v12.3,8.9 | X1.4 23.3,8.89 C43.2 v23.69,7.6 v23.7,7.6 | X1.2 25.3,13.51 C42.2 v24.91,14.8 v24.9,14.8 | C41.1 v32.8,15.7 | IC4.10 42.12,11.38 42.5,11 42.5,8 v42.1,7.6 42.12,7.58 IC4.7 | C44.1 26.81,6.19 v27.3,6.7
  Top 0.35: 55.33,20.73 IC2.7 57.52,20.73 57.81,21.01 C16.1 58.69,21.7 61.1,21.7 61.4,21.4 v61.4,21.1 | 55.33,20.73 IC2.BODY1 | C15.1 v61.4,20.4 v61.4,21.1 | v61.4,21.1 v61.4,19.7 62.1,19.7 62.11,19.91 C13.1 | v61.4,21.1 62,21.1 62.01,20.99 C14.2 | v54.6,19.9 55,19.9 | 55,19.9 v55.4,19.9 55.33,19.98 55.33,20.73 | v54.6,20.9 v55.4,20.9 55.4,20.3 55,19.9 | C39.1 27.4,18.1 | 27.4,18.1 C40.1 | IC8.2 25.1,18.7 25.7,18.1 v26,18.1 26.1,18.1 27.4,18.1
  Top 0.4: IC1.24 60.17,8.62 61,7.8 62,7.8 | C12.2 C11.1 62,7.8 | IC1.19 59.62,5.38 v59.8,5.2 | v61.8,8.1 61.8,7.9 62,7.8 | C6.2 C5.2 v59.61,12.61 v59.6,12.6 v58.9,12.6 v58.2,12.6 | C10.1 C9.1 60,1.4 59.61,1.79 59.21,1.79 v59.3,1.8 v58.6,1.8 v57.9,1.8 | IC3.5 11.39,13.9 v12.2,13.1 | C27.1 7.1,8.9 v6.1,8.9 | C28.1 v12.3,8.9 | v25.2,18.1 26.1,18.1
  Top 0.6: v54.1,0.7 v54.8,0.7 | v54.8,0.7 54.8,4.2 | v55.5,0.7 v54.8,0.7 | v54.8,0.7 55.4,0.7 55.4,4.4 v55.8,4.4
  Bottom 0.152: 34.3,19.1 34.3,20.2 36.2,22.1 54.7,22.1 54.7,22.3
  Bottom 0.254: K3.4 31.62,5.18 31.6,5.2
  Bottom 0.6: v23.7,7.6 21.6,9.7 19.5,9.7 | U5.B 21.3,1.6 22.2,0.7 v54.1,0.7 v54.8,0.7 v55.5,0.7 | U4.B 54.7,22.8 54.7,22.3
  Bottom 1: v47.4,14.5 v50.4,14.5 v53.4,14.5 v56.4,14.5 v59.4,14.5 v62.4,14.5 | v62.4,14.5 62.4,12 62,12 | v62.4,14.5 63.7,14.5 64.2,15 64.2,17.7 63.3,18.6
  other vias: 54.2,9.6 55.8,9.6 55.8,7 54.2,4.4 54.2,5.8 55.8,5.6 54.2,8.4 55.8,8.2 60.8,8 31,11 30,12 30,10 32,10 32,12
  pour Bottom: 53.9,13 64,13 64,1.3 53.9,1.3
  pour Bottom: 54,23 64,23 64,18 54,18
  pour Bottom: 22.8,5 22.8,9 26,9 26,13.4 23.8,13.4 23.8,19.2 34.4,19.2 34.4,8 43,8 43,3 34,3 34,5
  pour Bottom: 4.8,14.2 4.8,8.5 12.4,8.5 13.4,9.5 19.8,9.5 19.8,14.2
GVDD
  Top 0.254: IC1.10 50.2,5.38 | 50.2,5.38 49.41,5.38 C2.1 | IC1.9 50.42,6.03 50.2,5.8 50.2,5.38
N$1
  Top 0.254: IC3.7 8.9,11.37 R14.1
N$2
  Top 0.254: IC4.12 40.83,12.93 42.08,14.18 C24.2
N$3
  Top 0.254: IC3.6 8.9,12.63 R15.1
N$4
  Top 0.152: IC5.3 13.69,19.34 13.45,19.1 13.45,15.94 C29.1
  Top 0.6: IC5.3 16.6,19.34 L2.1
N$5
  Top 0.152: C29.2 15.01,16.8 IC5.1
N$6
  Top 0.152: IC6.3 13.73,5.83 13.45,5.55 13.45,2.44 C34.1
  Top 0.6: IC6.3 16.6,5.83 L3.1
N$7
  Top 0.152: C34.2 15.01,3.29 IC6.1
N$8
  Top 0.35: IC2.5 56.98,19.41 57.8,18.6 FB3.1
N$9
  Top 0.254: IC1.14 49.88,2.77 R3.2
N$10
  Top 0.4: IC6.6 8.95,5.83 C38.2
N$11
  Top 0.4: IC5.6 8.95,19.34 C33.2
N$12
  Top 0.35: IC2.8 56.98,21.38 57.8,22.2 FB4.1
N$13
  Top 0.35: FB4.2 63.01,22.6 C14.1
  Top 0.4: K2.2 66.83,15.97 64.8,18 64.8,21.5 64.09,22.21 C14.1
N$14
  Top 0.35: FB3.2 63.31,18.6 C13.2
  Top 0.4: C13.2 63.4,18.2 65.9,15.7 65.9,14.2 66.55,13.55 66.6,13.5 66.67,13.43 K2.1
N$15
  Top 0.4: C33.1 6.49,16.88 R16.1
N$16
  Top 0.4: C38.1 6.31,4.6 R19.1
N$17
  Top 0.4: C32.2 8.89,16.8 IC5.8
N$18
  Top 0.4: IC6.8 8.89,3.29 C37.2
N$19
  Top 0.254: IC7.2 26.98,12.62 26.2,13.4 R22.1
N$20
  Top 0.35: IC2.3 52.28,20.07 R5.2
N$21
  Top 0.35: IC2.4 53.03,19.43 R6.2
N$22
  Top 0.35: R6.1 C18.1
N$23
  Top 0.35: R5.1 C17.1
N$24
  Top 0.152: IC7.13 31.32,7.12 31,6.8 28.5,6.8 27.01,5.31
  Top 0.254: R23.2 27.01,5.31
N$25
  Top 0.152: R24.2 28.09,5.79 28.7,6.4 31.3,6.4 31.98,7.08 IC7.14
N$26
  Top 0.254: IC7.5 26.02,10.68 X1.1 25.3,8.89 C43.1
N$27
  Top 0.254: IC7.4 24.43,11.32 X1.3 23.3,13.51 C42.1
N$28
  Bottom 0.6: K4.4 3.8,15.62 U1.B U3.B U2.B
OUTL
  Top 0.4: FB1.1 62.38,8.99 C7.1 60.81,8.99 60.52,9.28 IC1.25 57.08,9.28 56.8,9 56.8,8.2 57.02,7.97 IC1.23
OUTR
  Top 0.4: IC1.18 57.08,4.72 56.8,5 56.8,5.8 57.02,6.03 IC1.20 60.17,6.03 60.41,5.79 C8.1 61.79,5.2 FB2.1
PGND5  (via drill 0.38)
  Top 0.4: C32.1 10.7,16.19 10.7,18.7 IC5.EP 11.8,18.8 v11.1,19.5 v11.1,17.9 v12.5,17.9 v12.5,19.5 | C30.1 17.1,21.7 | 17.1,21.7 v17.5,22.1 v17.5,21.3 17.1,21.7 | R16.2 5.19,17.59 v5.4,17.8 5.4,18.31 R17.2
  Top 0.6: IC5.EP 11.8,18.9 13.5,20.6 IC5.4 | IC5.4 | IC5.4 15.53,20.6 C30.1 | C31.1 17.1,15.5 v17.5,15.9 v17.5,15.1
  Bottom 0.6: v17.5,22.1 22.1,22.1 22.8,22.8 U4.A
  other vias: 11.8,18.7
  pour Bottom: 4.8,22.4 4.8,14.7 19.8,14.7 19.8,17.3 13,17.3 13,20.2 13.7,20.9 17.9,20.9 17.9,22.4
PGNDW  (via drill 0.38)
  Top 0.4: R20.2 6.39,5.9 R19.2 v5.3,7.6 | C37.1 10.7,2.69 10.7,3.8 10.8,3.9 11.8,3.9 | C35.1 17.1,8 v17.5,8.4 v17.5,7.6 | C36.1 19.1,2.5 v18.7,2.9 v18.7,2.1
  Top 0.6: C35.1 15.73,7.11 IC6.4 13.4,7.11 11.8,5.5 IC6.EP | IC6.EP 11.8,3.9 | IC6.EP v11.1,5.9 | IC6.EP v12.5,5.9 v12.5,4.5 v11.1,4.5
  other vias: 11.8,5.2
  pour Bottom: 4.8,7.9 4.8,1.3 19.8,1.3 19.8,3.6 13,3.6 13,7.2 19.8,7.2 19.8,8.9 15.5,8.9 14.5,7.9
PVCCW  (via drill 0.38, 0.6)
  Top 0.152: R21.1 6.49,7.49
  Top 0.203: 6.49,7.49 7,8 15.4,8 15.6,8.2 15.6,9 15.9,9.3 18.6,9.3 19.57,8.33 C35.2
  Top 0.254: R2.1 v45.59,6.61 v45.6,6.6
  Top 0.4: 62.81,11.39 v63,11.2 v63.2,10.4 v62.4,10.6 | v62.4,10.6 62,11 C6.1 C5.1 60.44,11.22 59.6,11.22 | 62.81,2.61 v63,2.8 v63.2,3.6 v62.4,3.4 62,3 C10.2 | v62.4,10.6 62.9,11.1 | C35.2 19.57,5.43 L3.2 19.6,5.5 | C10.2 C9.2 60.44,2.77 IC1.15 IC1.16 | C10.2 62.79,2.61 62.8,2.6 | IC1.28 59.6,11.22 | IC1.27 58.95,10.57 59.6,11.22
  Top 0.6: L3.2 21.1,5.4 v21.1,5.7 21.3,5.3 v21.1,5 21.4,5.3 v21.7,5.3
  Top 1: v47.4,16.5 v50.4,16.5 v53.4,16.5 v56.4,16.5 v59.4,16.5 v62.4,16.5 63.3,16.5 64.2,15.6 64.2,12.4 62.9,11.1 62.7,10.9
  Bottom 0.254: 45.2,1.6 45.2,6.2 v45.6,6.6
  Bottom 0.5: v63.2,3.6 63.8,4.2 63.8,9.8 v63.2,10.4 | v63.2,10.4 v63,11.2 v62.4,10.6 v63.2,10.4 | v63.2,3.6 v62.4,3.4 v63,2.8 v63.2,3.6
  Bottom 0.6: v63,2.8 63,1.1 62.6,0.7 57.6,0.7 56.5,1.8 53.4,1.8 53.2,1.6 45.2,1.6 22.8,1.6 21.7,2.7 v21.7,5.3 21.3,5.3 | v21.1,5 21.3,5.3 | v21.1,5.7 21.3,5.3
RINN
  Top 0.254: IC1.11 47.28,4.72 C3.1
RINP
  Top 0.254: IC1.12 49.88,4.08 C4.1
RXD
  Top 0.152: IC3.1 16.59,10.1 17,10.5 21.4,10.5 21.9,11 21.9,15.1 22.9,16.1 22.9,20.2 24.2,21.5 28.3,21.5 29.38,20.43 IC7.31
SCK  (via drill 0.38)
  Top 0.152: IC4.1 38.23,5.72 38.1,5.6 38.1,5 37.9,4.8 35.6,4.8 v35.3,5.1 | IC7.15 32.62,5.47 33.1,5 v33.5,5
  Bottom 0.152: v33.5,5 35.2,5 v35.3,5.1
SDAT
  Top 0.152: IC4.3 39.52,5.92 38.9,5.3 38.9,4.4 38.4,3.9 34.8,3.9 34.2,4.5 34.2,7.2 35,8 35,9.2 34.83,9.38 IC7.18
TWEETER
  Top 0.254: J2.2 36.4,19.6 36.8,20 C17.2
TX/!RX
  Top 0.152: IC3.3 16.86,12.63 18.4,11 21.1,11 21.5,11.4 21.5,15.3 22.5,16.3 22.5,20.4 24,21.9 28.8,21.9 30.02,20.68 IC7.30
  Top 0.254: IC3.3 IC3.2 14.37,11.37 14,11 14,9.8 14.51,9.29 R13.1
TXD  (via drill 0.38)
  Top 0.152: IC3.4 17.59,13.9 19.7,11.8 v20.8,11.8 | IC7.32 28.73,20.18 27.8,21.1 24.4,21.1 23.3,20 23.3,15.9 23,15.6 23,14.2 v22.6,13.8
  Bottom 0.152: v20.8,11.8 21.4,11.8 22,12.4 22,13.2 v22.6,13.8
VIN  (via drill 0.38)
  Top 0.152: IC5.7 8.96,18.07 5.3,14.4 1.2,14.4 0.6,13.8 0.6,9.1 1.7,8 K4.1 | IC6.7 8.87,4.57 7.6,3.3 v7.5,3.3
  Top 0.6: IC5.2 14.84,18.07 16,16.9 18.4,16.9 19.57,15.73 C31.2 19.57,14.07 v19.5,14 v18.8,14 | IC6.2 14.84,4.57 16.63,2.77 C36.2 16.63,1.33 16.2,0.9 8.3,0.9 7.5,1.7 v7.5,3.3 v6.7,3.3 | K4.1 4.2,8 5,8.8 v5,9.9 v5,10.5
  Bottom 0.6: v19.5,14 v18.8,14 5.8,14 5,13.2 v5,10.5 v5,9.9 | v7.5,3.3 v6.7,3.3 arc90 4.2,6.1 3.2,6.1 2,7.3 K4.1
WCLK
  Top 0.152: IC4.2 38.88,5.78 38.5,5.4 38.5,4.8 38,4.3 35.1,4.3 34.6,4.8 34.6,7 35.4,7.8 35.4,10.8 34.88,11.32 IC7.21
WFB
  Top 0.4: R20.1 R21.2 7.8,7.11 IC6.5
WOOFER
  Top 0.254: C3.2 44.9,4.8 44.5,5.2 44.5,17.9 43.8,18.6 J1.2
WOOFER-FAULT
  Top 0.254: IC1.2 52.98,10.57 53.3,10.9 53.3,11.8 52.8,12.3 51.31,12.3 R12.2
WOOFERL
  Top 0.4: C11.2 FB1.2 67.17,9.2 K1.1
WOOFERR
  Top 0.4: FB2.2 C12.1 67.23,6.6 K1.2